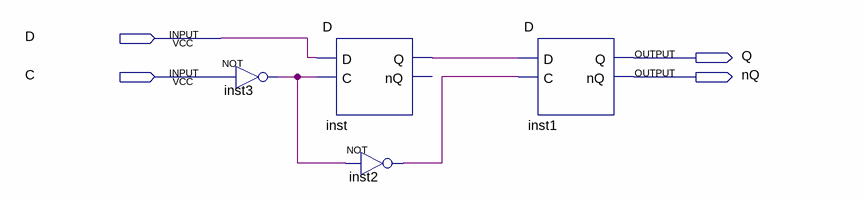
[diagram p0: schematic sheet]
// Quartus schematic Dflipflop.bdf as structural Verilog: 4 symbols, 4 pins
module Dflipflop (
  input  D,
  input  C,
  output Q,
  output nQ
);

  wire inst2_out, inst3_out, inst_q;

  not inst3 (inst3_out, C);
  D inst (.D(D), .C(inst3_out), .Q(inst_q));  // open: nQ
  not inst2 (inst2_out, inst3_out);
  D inst1 (.D(inst_q), .C(inst2_out), .Q(Q), .nQ(nQ));
endmodule
